# Altium schematic sheet US_EPS_HW.SchDoc
size A3
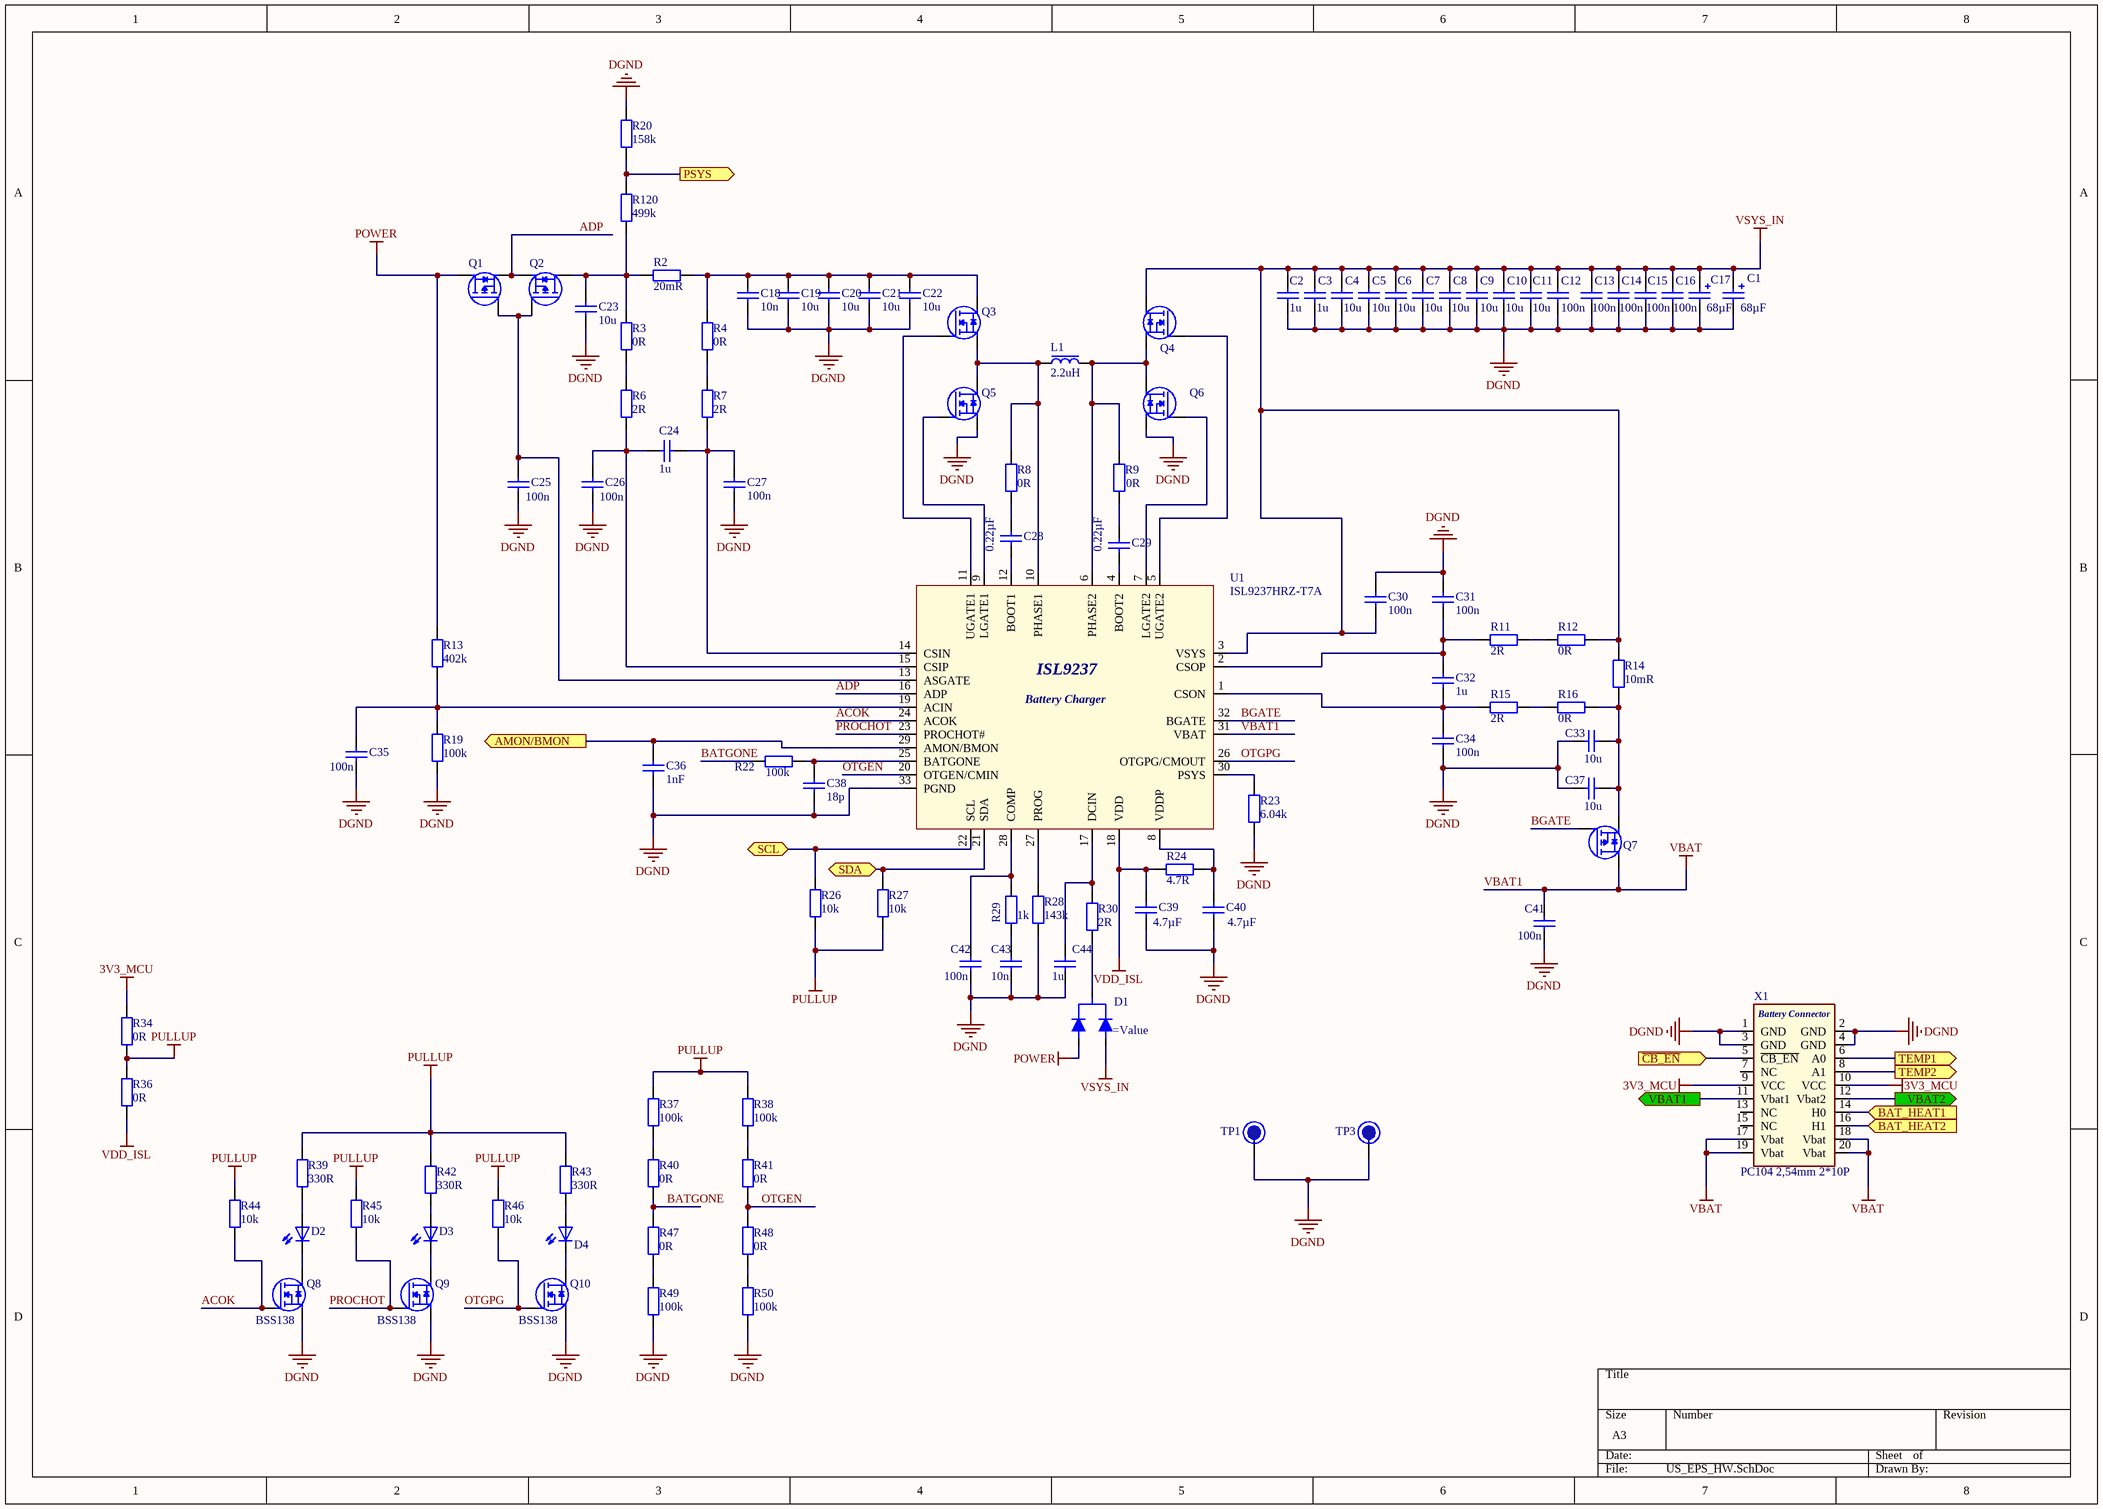
[diagram p0: US_EPS_HW.SchDoc]

## Parts
C1  68µF  [TCJY686_CAPMP7343X21N]
C2  1u  [C0603_IPC_HD]
C3  1u  [C0603_IPC_HD]
C4  10u  [C0805_IPC_HD]
C5  10u  [C0805_IPC_HD]
C6  10u  [C0805_IPC_HD]
C7  10u  [C0805_IPC_HD]
C8  10u  [C0805_IPC_HD]
C9  10u  [C0805_IPC_HD]
C10  10u  [C0805_IPC_HD]
C11  10u  [C0805_IPC_HD]
C12  100n  [C0603_IPC_HD]
C13  100n  [C0603_IPC_HD]
C14  100n  [C0603_IPC_HD]
C15  100n  [C0603_IPC_HD]
C16  100n  [C0603_IPC_HD]
C17  68µF  [TCJY686_CAPMP7343X21N]
C18  10n  [C0603_IPC_HD]
C19  10u  [C0805_IPC_HD]
C20  10u  [C0805_IPC_HD]
C21  10u  [C0805_IPC_HD]
C22  10u  [C0805_IPC_HD]
C23  10u  [C0805_IPC_HD]
C24  1u  [C0603_IPC_HD]
C25  100n  [C0603_IPC_HD]
C26  100n  [C0603_IPC_HD]
C27  100n  [C0603_IPC_HD]
C28  0.22µF  [C0603_IPC_MD]
C29  0.22µF  [C0603_IPC_MD]
C30  100n  [C0603_IPC_HD]
C31  100n  [C0603_IPC_HD]
C32  1u  [C0603_IPC_HD]
C33  10u  [C0805_IPC_HD]
C34  100n  [C0603_IPC_HD]
C35  100n  [C0603_IPC_HD]
C36  1nF  [C0603_IPC_MD]
C37  10u  [C0805_IPC_HD]
C38  18p  [C0603_IPC_HD]
C39  4.7µF  [C0603_IPC_MD]
C40  4.7µF  [C0603_IPC_MD]
C41  100n  [C0603_IPC_HD]
C42  100n  [C0603_IPC_HD]
C43  10n  [C0603_IPC_HD]
C44  1u  [C0603_IPC_HD]
D1  (no value)  [BAT54C_SOT23]
D2  LTST-C190GKT  [LED_0603]  (value not drawn)
D3  LTST-C190GKT  [LED_0603]  (value not drawn)
D4  LTST-C190GKT  [LED_0603]  (value not drawn)
L1  2.2uH  [2.2uF_6.3A]
Q1  SISH625DN-T1-GE3  [SISH625DN]  (value not drawn)
Q2  SISH625DN-T1-GE3  [SISH625DN]  (value not drawn)
Q3  SISA14DN-T1-GE3  [SISA14DN]  (value not drawn)
Q4  SISA14DN-T1-GE3  [SISA14DN]  (value not drawn)
Q5  SISA14DN-T1-GE3  [SISA14DN]  (value not drawn)
Q6  SISA14DN-T1-GE3  [SISA14DN]  (value not drawn)
Q7  SISH625DN-T1-GE3  [SISH625DN]  (value not drawn)
Q8  BSS138  [SOT23]
Q9  BSS138  [SOT23]
Q10  BSS138  [SOT23]
R2  20mR  [WSLP1206R002]
R3  0R  [R0603_IPC_MD]
R4  0R  [R0603_IPC_MD]
R6  2R  [C0603_IPC_HD]
R7  2R  [C0603_IPC_HD]
R8  0R  [R0603_IPC_MD]
R9  0R  [R0603_IPC_MD]
R11  2R  [C0603_IPC_HD]
R12  0R  [R0603_IPC_MD]
R13  402k  [C0603_IPC_HD]
R14  10mR  [WSLP1206R001]
R15  2R  [C0603_IPC_HD]
R16  0R  [R0603_IPC_MD]
R19  100k  [R0603_IPC_MD]
R20  158k  [R0603_IPC_HD]
R22  100k  [R0603_IPC_MD]
R23  6.04k  [C0603_IPC_HD]
R24  4.7R  [R0603_IPC_HD]
R26  10k  [C0603_IPC_HD]
R27  10k  [C0603_IPC_HD]
R28  143k  [C0603_IPC_HD]
R29  1k  [R0603_IPC_MD]
R30  2R  [C0603_IPC_HD]
R34  0R  [R0603_IPC_MD]
R36  0R  [R0603_IPC_MD]  (no BOM)
R37  100k  [R0603_IPC_MD]
R38  100k  [R0603_IPC_MD]
R39  330R  [R0603_IPC_MD]
R40  0R  [R0603_IPC_MD]
R41  0R  [R0603_IPC_MD]
R42  330R  [R0603_IPC_MD]
R43  330R  [R0603_IPC_MD]
R44  10k  [C0603_IPC_HD]
R45  10k  [C0603_IPC_HD]
R46  10k  [C0603_IPC_HD]
R47  0R  [R0603_IPC_MD]  (no BOM)
R48  0R  [R0603_IPC_MD]  (no BOM)
R49  100k  [R0603_IPC_MD]
R50  100k  [R0603_IPC_MD]
R120  499k  [C0603_IPC_HD]
TP1  Test Point  [TestPoint_1M5]  (value not drawn)  (no BOM)
TP3  Test Point  [TestPoint_1M5]  (value not drawn)  (no BOM)
U1  ISL9237HRZ-T7A  [QFN127P600-ISL9237]
X1  PC104 2,54mm 2*10P  [ESQ-110-33-T-D]

## Ports
AMON/BMON (out), BAT_HEAT1 (in), BAT_HEAT2 (in), PSYS (out), SCL, SDA, TEMP1 (out), TEMP2 (out), VBAT1 (out), VBAT2 (out), ~{CB_EN} (in)

## Nets
3V3_MCU: R34.2 X1.9(VCC) X1.10(VCC)
DGND: C1.2 C2.1 C3.1 C4.1 C5.1 C6.1 C7.1 C8.1 C9.1 C10.1 C11.1 C12.1 C13.1 C14.1 C15.1 C16.1 C17.2 C18.1 C19.1 C20.1 C21.1 C22.1 C23.1 C25.1 C26.1 C27.1 C30.1 C31.1 C33.2 C34.2 C35.1 C36.1 C37.2 C38.1 C39.1 C40.1 C41.2 C42.2 C43.1 C44.1 Q5.1(S) Q6.1(S) Q8.2(S) Q9.2(S) Q10.2(S) R19.1 R20.2 R23.1 R28.1 R49.1 R50.1 TP1.0 TP3.0 U1.33(PGND) X1.1(GND) X1.2(GND) X1.3(GND) X1.4(GND)
POWER: D1.1 Q1.3(D) R13.2
PULLUP: R26.2 R27.1 R34.1 R36.2 R37.2 R38.2 R39.2 R42.2 R43.2 R44.2 R45.2 R46.2
VBAT1: C41.1 Q7.3(D) U1.31(VBAT) X1.17(Vbat) X1.18(Vbat) X1.19(Vbat) X1.20(Vbat)  [also labelled VBAT]
VDD_ISL: C39.2 R24.2 R36.1 U1.18(VDD)
VSYS_IN: C1.1 C2.2 C3.2 C4.2 C5.2 C6.2 C7.2 C8.2 C9.2 C10.2 C11.2 C12.2 C13.2 C14.2 C15.2 C16.2 C17.1 C30.2 D1.2 Q4.3(D) R12.1 R14.2 U1.3(VSYS)
ACOK: Q8.1(G) R44.1 U1.24(ACOK)
ADP: Q1.1(S) Q2.1(S) U1.16(ADP)
AMON/BMON: C36.2 U1.29(AMON/BMON) ; port AMON/BMON
BAT_HEAT1: X1.14(H0) ; port BAT_HEAT1
BAT_HEAT2: X1.16(H1) ; port BAT_HEAT2
BATGONE: R22.1 R40.1 R47.2
BGATE: Q7.2(G) U1.32(BGATE)
~{CB_EN}: X1.5(~{CB_EN}) ; port ~{CB_EN}
OTGEN: R41.1 R48.2 U1.20(OTGEN/CMIN)
OTGPG: Q10.1(G) R46.1 U1.26(OTGPG/CMOUT)
PROCHOT: Q9.1(G) R45.1 U1.23(PROCHOT#)
PSYS: R20.1 R120.2 ; port PSYS
SCL: R26.1 U1.22(SCL) ; port SCL
SDA: R27.2 U1.21(SDA) ; port SDA
TEMP1: X1.6(A0) ; port TEMP1
TEMP2: X1.8(A1) ; port TEMP2
VBAT1: X1.11(Vbat1) ; port VBAT1  [a separate net that carries the same name]
VBAT2: X1.12(Vbat2) ; port VBAT2
NetC18_2: C18.2 C19.2 C20.2 C21.2 C22.2 Q3.3(D) R2.2 R4.2
NetC23_2: C23.2 Q2.3(D) R2.1 R3.2 R120.1
NetC24_1: C24.1 C26.2 R6.1 U1.15(CSIP)
NetC24_2: C24.2 C27.2 R7.1 U1.14(CSIN)
NetC25_2: C25.2 Q1.2(G) Q2.2(G) U1.13(ASGATE)
NetC28_1: C28.1 U1.12(BOOT1)
NetC28_2: C28.2 R8.1
NetC29_1: C29.1 R9.1
NetC29_2: C29.2 U1.4(BOOT2)
NetC31_2: C31.2 C32.2 R11.2 U1.2(CSOP)
NetC32_1: C32.1 C34.1 R15.2 U1.1(CSON)
NetC33_1: C33.1 C37.1 Q7.1(S) R14.1 R16.1
NetC35_2: C35.2 R13.1 R19.2 U1.19(ACIN)
NetC38_2: C38.2 R22.2 U1.25(BATGONE)
NetC40_2: C40.2 R24.1 U1.8(VDDP)
NetC42_1: C42.1 R29.2 U1.28(COMP)
NetC43_2: C43.2 R29.1
NetC44_2: C44.2 R30.2 U1.17(DCIN)
NetD1_3: D1.3 R30.1
NetD2_1: D2.1(C) Q8.3(D)
NetD2_2: D2.2(A) R39.1
NetD3_1: D3.1(C) Q9.3(D)
NetD3_2: D3.2(A) R42.1
NetD4_1: D4.1(C) Q10.3(D)
NetD4_2: D4.2(A) R43.1
NetL1_1: L1.1 Q3.1(S) Q5.3(D) R8.2 U1.10(PHASE1)
NetL1_2: L1.2 Q4.1(S) Q6.3(D) R9.2 U1.6(PHASE2)
NetQ3_2: Q3.2(G) U1.11(UGATE1)
NetQ4_2: Q4.2(G) U1.5(UGATE2)
NetQ5_2: Q5.2(G) U1.9(LGATE1)
NetQ6_2: Q6.2(G) U1.7(LGATE2)
NetR3_1: R3.1 R6.2
NetR4_1: R4.1 R7.2
NetR11_1: R11.1 R12.2
NetR15_1: R15.1 R16.2
NetR23_2: R23.2 U1.30(PSYS)
NetR28_2: R28.2 U1.27(PROG)
NetR37_1: R37.1 R40.2
NetR38_1: R38.1 R41.2
NetR47_1: R47.1 R49.2
NetR48_1: R48.1 R50.2

Not connected (* = marked no-connect by the designer): X1 7(NC) 13(NC) 15(NC)

## Notes on the sheet
- (in symbol ISL9237HRZ-T7A) ISL9237; Battery Charger
- (in symbol PC104_2.54mm_20P) Battery Connector

## Library data of the parts
C1 C17 = CPT68uF_16V: 68µF Molded Tantalum Polymer Capacitor 16V 2917 (7343 Metric) 50 mOhm; Manufacturer: AVX Corporation; Manufacturer Part Number: TCJY686M016R0050; Dielectric: X7R; Voltage: 16V; Value: 68µF; Supplier 1: Digi-Key; Supplier Part Number 1: 478-9518-1-ND
C2 C3 C24 C32 C44 = CL10B105MO8NNWC: CAP CER 1UF 16V X7R 0603; Manufacturer: Samsung Electro-Mechanics; Manufacturer Part Number: CL10B105MO8NNWC; Voltage: 16V; Value: 1u; Dielectric: X7R; Supplier 1: Digi-Key; Supplier Part Number 1: 1276-6524-1-ND
C4-C11 C19-C23 C33 C37 = CL21B106KOQNNNG: CAP CER 10UF 16V X7R 0805; Manufacturer: Samsung Electro-Mechanics; Manufacturer Part Number: CL21B106KOQNNNG; Voltage: 16V; Value: 10u; Dielectric: X7R; Supplier 1: Digi-Key; Supplier Part Number 1: 1276-6472-1-ND
C12-C16 C25-C27 C30 C31 C34 C35 C41 C42 = CL10B104KO8NNNC: CAP CER 0.1UF 16V X7R 0603; Manufacturer: Samsung Electro-Mechanics; Manufacturer Part Number: CL10B104KO8NNNC; Voltage: 16V; Value: 100n; Dielectric: X7R; Supplier 1: Digi-Key; Supplier Part Number 1: 1276-1005-1-ND
C18 C43 = CL10B103KB8NNNC: CAP CER 0.01UF 50V X7R 0603; Manufacturer: Samsung Electro-Mechanics; Manufacturer Part Number: CL10B103KB8NNNC; Voltage: 50V; Value: 10n; Dielectric: X7R; Supplier 1: Digi-Key; Supplier Part Number 1: 1276-1009-1-ND
C28 C29 = CL0603_0.22uF_25V: 0.22µF ±10% 25V Ceramic Capacitor X7R 0603 (1608 Metric); Manufacturer: Wurth Electronics Inc.; Manufacturer Part Number: 885012206073; Voltage: 25V; Value: 0.22µF; Dielectric: X7R; Supplier 1: Digi-Key; Supplier Part Number 1: 732-7991-1-ND
C36 = CL0603_1nF_0603: CAP CER 1000PF 50V X7R 0603; Manufacturer: Samsung Electro-Mechanics; Manufacturer Part Number: CL10B102KB8NNNC; Voltage: 50V; Value: 1nF; Dielectric: X7R; Supplier 1: Digi-Key; Supplier Part Number 1: 1276-1018-1-ND
C38 = CL10C180JB8NNNC: CAP CER 18PF 50V C0G/NP0 0603; Manufacturer: Samsung Electro-Mechanics; Manufacturer Part Number: CL10C180JB8NNNC; Voltage: 50V; Value: 18p; Dielectric: C0G/NP0; Supplier 1: Digi-Key; Supplier Part Number 1: 1276-1089-1-ND
C39 C40 = CL0603_4.7uF_10V: 4.7µF ±10% 10V Ceramic Capacitor X5R 0603 (1608 Metric); Manufacturer: Samsung Electro-Mechanics; Manufacturer Part Number: CL10A475KP8NNNC; Dielectric: X7R; Voltage: 10V; Value: 4.7µF; Supplier 1: Digi-Key; Supplier Part Number 1: 1276-1044-1-ND
D1 = BAT54CQ-7: Diode Schottky 30V 200mA Surface Mount SOT-23(ISL9237); Manufacturer: Diodes Incorporated; Manufacturer Part Number: BAT54CQ-7-F; Reverse Recovery Time (trr): 5ns; Voltage - DC Reverse (Vr) (Max): 30V; Supplier 1: Digi-Key; Supplier Part Number 1: BAT54CQ-7-FDICT-ND; Current - Average Rectified (Io): 200mA
D2-D4 = LTST-C190GKT: LED GREEN CLEAR CHIP SMD 0603; Manufacturer: Lite-On Inc.; Manufacturer Part Number: LTST-C190GKT; Color: Green; Supplier 1: Digi-Key; Supplier Part Number 1: 160-1183-1-ND
L1 = 2.2uH Inductor 6.3A 13 mOm: 2.2µH Semi-Shielded Wirewound Inductor 6.3A 13 mOhm Max Nonstandard; Manufacturer: Bourns Inc.; Manufacturer Part Number: SRN8040-2R2Y; Value: 2.2uH; Supplier 1: Digi-Key; Supplier Part Number 1: SRN8040-2R2YCT-ND
Q1 Q2 Q7 = SISH625DN-T1: P-Channel 30V 17.3A (Ta), 35A (Tc) 3.7W (Ta), 52W (Tc) Surface Mount PowerPAK® 1212-8SH; Manufacturer: Vishay Siliconix; Manufacturer Part Number: SISH625DN-T1-GE3; Supplier 1: Digi-Key; Supplier Part Number 1: SISH625DN-T1-GE3CT-ND
Q3-Q6 = SiSA14DN: N-Channel 30V 20A (Tc) 3.57W (Ta), 26.5W (Tc) Surface Mount PowerPAK® 1212-8; Manufacturer: Vishay Siliconix; Manufacturer Part Number: SISA14DN-T1-GE3; Supplier 1: Digi-Key; Supplier Part Number 1: SISA14DN-T1-GE3CT-ND
Q8-Q10 = BSS138: N-Channel Logic Level Enhancement Mode Field Effect Transistor; Manufacturer: Diodes Incorporated; Manufacturer Part Number: BSS138; Supplier 1: Digi-Key; Supplier Part Number 1: BSS138-FDICT-ND
R2 = WSLP1206R002: 20 mOhms ±1% 1W Chip Resistor 1206 (3216 Metric) Anti-Sulfur, Automotive AEC-Q200, Current Sense, Moisture Resistant, Pulse Withstanding Metal Element; Manufacturer: Vishay Dale; Manufacturer Part Number: WSLP1206R0200FEA; Value: 20mR; Tolarance: 1%; Supplier 1: Digi-Key; Supplier Part Number 1: WSLP-.02CT-ND
R3 R4 R8 R9 R12 R16 R34 R36 R40 R41 R47 R48 = CR0603-J/-000ELF: RES SMD 0 OHM JUMPER 1/10W 0603; Manufacturer: Bourns Inc.; Tolarance: 1%; Value: 0R; Manufacturer Part Number: CR0603-J/-000ELF; Supplier 1: Digi-Key; Supplier Part Number 1: CR0603-J/-000ELFCT-ND
R6 R7 R11 R15 R30 = CR0603-JW-2R: 2 Ohms ±1% 0.125W, 1/8W Chip Resistor 0603 (1608 Metric) Automotive AEC-Q200 Thick Film; Manufacturer: KOA Speer Electronics, Inc.; Manufacturer Part Number: RK73H1JTTD2R00F; Value: 2R; Tolarance: ±1%; Supplier 1: Digi-Key; Supplier Part Number 1: 2019-RK73H1JTTD2R00FCT-ND
R13 = CR0603-JW-402K: RES 402K OHM 1% 1/10W 0603; Manufacturer: Stackpole Electronics Inc; Manufacturer Part Number: RMCF0603FT402K; Value: 402k; Tolarance: ±1%; Supplier 1: Digi-Key; Supplier Part Number 1: RMCF0603FT402KCT-ND
R14 = WSLP1206R001: 10 mOhms ±1% 1W Chip Resistor 1206 (3216 Metric) Anti-Sulfur, Automotive AEC-Q200, Current Sense, Moisture Resistant, Pulse Withstanding Metal Element; Manufacturer: Vishay Dale; Manufacturer Part Number: WSLP1206R0100FEA; Value: 10mR; Tolarance: 1%; Supplier 1: Digi-Key; Supplier Part Number 1: WSLP-.01CT-ND
R19 R22 R37 R38 R49 R50 = CR0603-JW-104ELF: RES 100K OHM 1% 1/10W 0603; Manufacturer: Stackpole Electronics Inc; Manufacturer Part Number: RMCF0603FT100K; Value: 100k; Tolarance: ±1%; Supplier 1: Digi-Key; Supplier Part Number 1: RMCF0603FT100KCT-ND
R20 = CR0603-JW-158k: 58K ±1% 1/10W ±100ppm/℃ 0603; Manufacturer: PANASONIC; Manufacturer Part Number: ERJ3EKF1583V; Value: 158k; Tolarance: 1%; Supplier 1: LCSC; Supplier Part Number 1: C403004
R23 = CR0603-JW-6.04K: RES 6.04K OHM 1% 1/10W 0603; Manufacturer: Stackpole Electronics Inc; Manufacturer Part Number: RMCF0603FT6K04; Value: 6.04k; Tolarance: ±1%; Supplier 1: Digi-Key; Supplier Part Number 1: RMCF0603FT6K04CT-ND
R24 = CR0603-JW-4.7R: RES 4.7 OHM 1% 1/10W 0603; Manufacturer: Stackpole Electronics Inc; Manufacturer Part Number: RMCF0603FT4R70; Value: 4.7R; Tolarance: ±1%; Supplier 1: Digi-Key; Supplier Part Number 1: RMCF0603FT4R70CT-ND
R26 R27 R44-R46 = CR0603-JW-10k: RES 10K OHM 1% 1/10W 0603; Manufacturer: Stackpole Electronics Inc; Manufacturer Part Number: RMCF0603FT10K0; Value: 10k; Tolarance: ±1%; Supplier 1: Digi-Key; Supplier Part Number 1: RMCF0603FT10K0CT-ND
R28 = CR0603-JW-147kR: RES 143K OHM 1% 1/10W 0603; Manufacturer: Stackpole Electronics Inc; Manufacturer Part Number: RMCF0603FT143K; Value: 143k; Tolarance: ±1%; Supplier 1: Digi-Key; Supplier Part Number 1: RMCF0603FT143KCT-ND
R29 = CR0603-JW-102ELF: RES SMD 1K OHM 5% 1/10W 0603; Manufacturer: Bourns Inc.; Value: 1k; Tolarance: 5%; Manufacturer Part Number: CR0603-JW-102ELF; Supplier 1: Digi-Key; Supplier Part Number 1: CR0603-JW-102ELFCT-ND
R39 R42 R43 = CR0603-JW-331ELF: RES SMD 330 OHM 5% 1/10W 0603; Manufacturer: Bourns Inc.; Value: 330R; Tolarance: 5%; Manufacturer Part Number: CR0603-JW-331ELF; Supplier 1: Digi-Key; Supplier Part Number 1: CR0603-JW-331ELFCT-ND
R120 = CR0603-JW-499K: RES 499K OHM 1% 1/10W 0603; Manufacturer: Stackpole Electronics Inc; Manufacturer Part Number: RMCF0603FT499K; Value: 499k; Tolarance: ±1%; Supplier 1: Digi-Key; Supplier Part Number 1: RMCF0603FT499KCT-ND
TP1 TP3 = TP
U1 = ISL9237HRZ-T7A: Charger IC Lithium-Ion 32-QFN (4x4); Manufacturer: Renesas Electronics America Inc.; Manufacturer Part Number: ISL9237HRZ-T7A; Supplier 1: Digi-Key; Supplier Part Number 1: ISL9237HRZ-T7ACT-ND
X1 = PC104_2.54mm_20P: 20 Position Elevated Socket Connector  Through Hole; Manufacturer: China; Number of Positions: 20; Manufacturer Part Number: PC104 2,54mm 2*10P; Supplier 1: Aliexpress.com; Supplier Part Number 1: PC104 2,54mm 2*10P